# Altium schematic sheet Relay.SchDoc
size A4; SheetNumber: 3; SheetTotal: 3
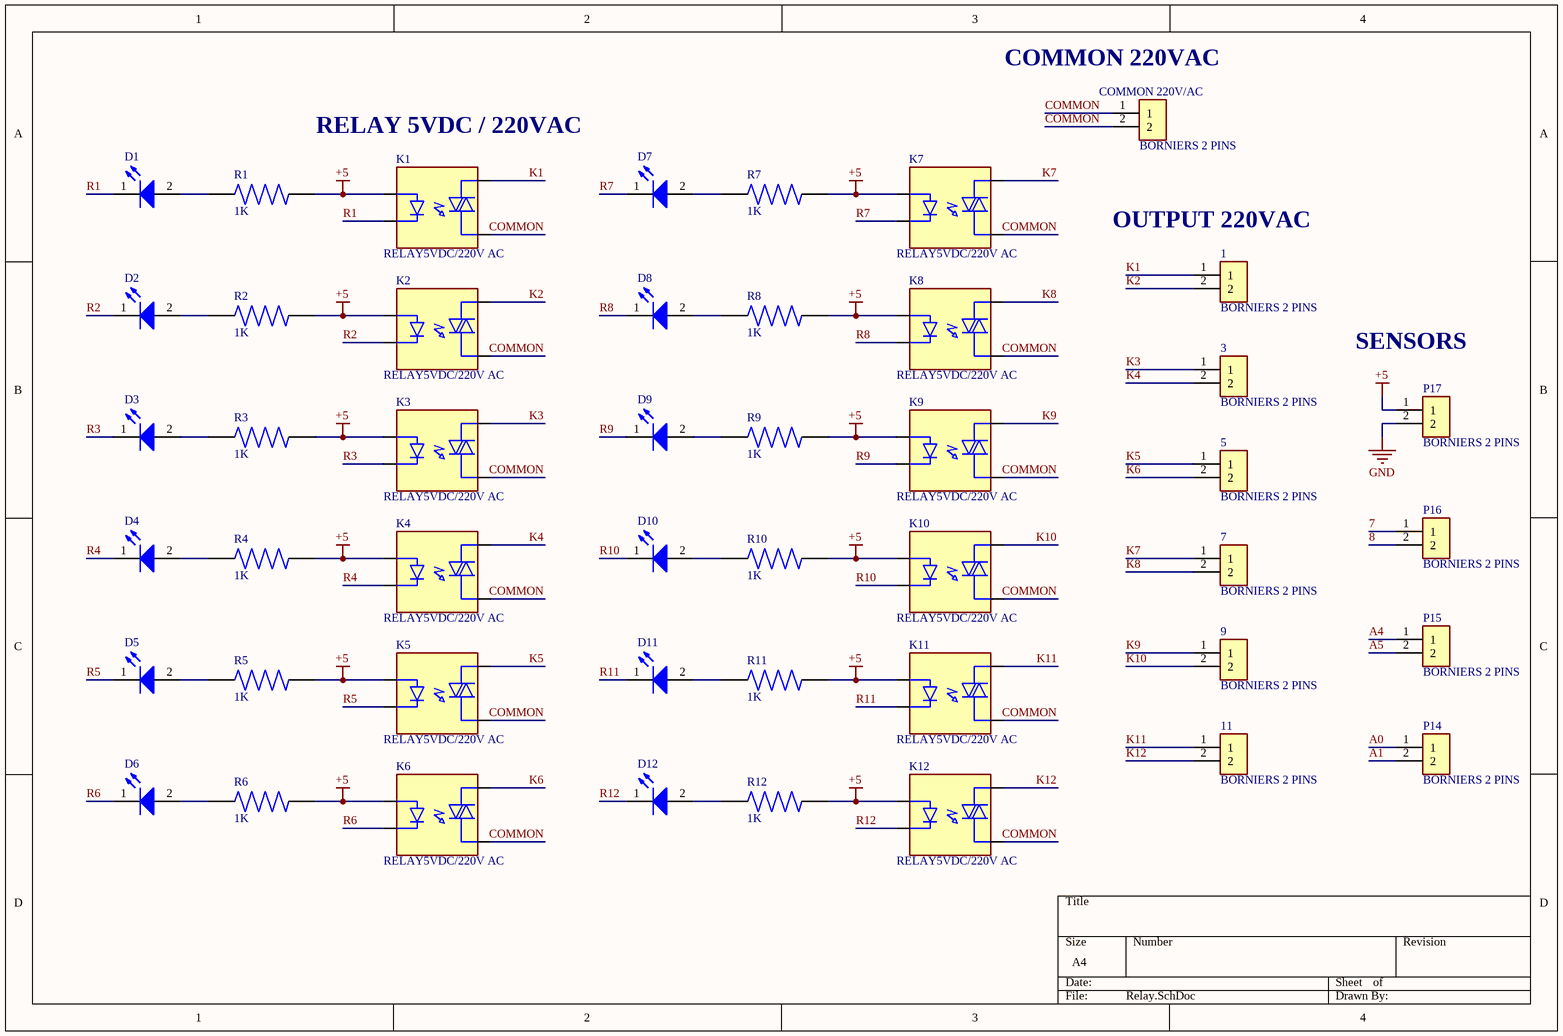
[diagram p0: Relay.SchDoc]

## Parts
1  BORNIERS 2 PINS  [BORNIERS 2 PINS]
3  BORNIERS 2 PINS  [BORNIERS 2 PINS]
5  BORNIERS 2 PINS  [BORNIERS 2 PINS]
7  BORNIERS 2 PINS  [BORNIERS 2 PINS]
9  BORNIERS 2 PINS  [BORNIERS 2 PINS]
11  BORNIERS 2 PINS  [BORNIERS 2 PINS]
COMMON_220V/AC  BORNIERS 2 PINS  [BORNIERS 2 PINS]
D1  LED 15408085BA400  [LED 15408085BA400]  (value not drawn)
D2  LED 15408085BA400  [LED 15408085BA400]  (value not drawn)
D3  LED 15408085BA400  [LED 15408085BA400]  (value not drawn)
D4  LED 15408085BA400  [LED 15408085BA400]  (value not drawn)
D5  LED 15408085BA400  [LED 15408085BA400]  (value not drawn)
D6  LED 15408085BA400  [LED 15408085BA400]  (value not drawn)
D7  LED 15408085BA400  [LED 15408085BA400]  (value not drawn)
D8  LED 15408085BA400  [LED 15408085BA400]  (value not drawn)
D9  LED 15408085BA400  [LED 15408085BA400]  (value not drawn)
D10  LED 15408085BA400  [LED 15408085BA400]  (value not drawn)
D11  LED 15408085BA400  [LED 15408085BA400]  (value not drawn)
D12  LED 15408085BA400  [LED 15408085BA400]  (value not drawn)
K1  RELAY5VDC/220V AC  [G3MB-202P DC5]
K2  RELAY5VDC/220V AC  [G3MB-202P DC5]
K3  RELAY5VDC/220V AC  [G3MB-202P DC5]
K4  RELAY5VDC/220V AC  [G3MB-202P DC5]
K5  RELAY5VDC/220V AC  [G3MB-202P DC5]
K6  RELAY5VDC/220V AC  [G3MB-202P DC5]
K7  RELAY5VDC/220V AC  [G3MB-202P DC5]
K8  RELAY5VDC/220V AC  [G3MB-202P DC5]
K9  RELAY5VDC/220V AC  [G3MB-202P DC5]
K10  RELAY5VDC/220V AC  [G3MB-202P DC5]
K11  RELAY5VDC/220V AC  [G3MB-202P DC5]
K12  RELAY5VDC/220V AC  [G3MB-202P DC5]
P14  BORNIERS 2 PINS  [BORNIERS 2 PINS]
P15  BORNIERS 2 PINS  [BORNIERS 2 PINS]
P16  BORNIERS 2 PINS  [BORNIERS 2 PINS]
P17  BORNIERS 2 PINS  [BORNIERS 2 PINS]
R1  1K  [RES FCR1206J10R]
R2  1K  [RES FCR1206J10R]
R3  1K  [RES FCR1206J10R]
R4  1K  [RES FCR1206J10R]
R5  1K  [RES FCR1206J10R]
R6  1K  [RES FCR1206J10R]
R7  1K  [RES FCR1206J10R]
R8  1K  [RES FCR1206J10R]
R9  1K  [RES FCR1206J10R]
R10  1K  [RES FCR1206J10R]
R11  1K  [RES FCR1206J10R]
R12  1K  [RES FCR1206J10R]

## Nets
+5: K1.3(ANODE) K2.3(ANODE) K3.3(ANODE) K4.3(ANODE) K5.3(ANODE) K6.3(ANODE) K7.3(ANODE) K8.3(ANODE) K9.3(ANODE) K10.3(ANODE) K11.3(ANODE) K12.3(ANODE) P17.1 R1.2 R2.2 R3.2 R4.2 R5.2 R6.2 R7.2 R8.2 R9.2 R10.2 R11.2 R12.2
GND: P17.2
7: P16.1
8: P16.2
A0: P14.1
A1: P14.2
A4: P15.1
A5: P15.2
COMMON: COMMON_220V/AC.1 COMMON_220V/AC.2 K1.2(LOAD2) K2.2(LOAD2) K3.2(LOAD2) K4.2(LOAD2) K5.2(LOAD2) K6.2(LOAD2) K7.2(LOAD2) K8.2(LOAD2) K9.2(LOAD2) K10.2(LOAD2) K11.2(LOAD2) K12.2(LOAD2)
K1: 1.1 K1.1(LOAD1)
K2: 1.2 K2.1(LOAD1)
K3: 3.1 K3.1(LOAD1)
K4: 3.2 K4.1(LOAD1)
K5: 5.1 K5.1(LOAD1)
K6: 5.2 K6.1(LOAD1)
K7: 7.1 K7.1(LOAD1)
K8: 7.2 K8.1(LOAD1)
K9: 9.1 K9.1(LOAD1)
K10: 9.2 K10.1(LOAD1)
K11: 11.1 K11.1(LOAD1)
K12: 11.2 K12.1(LOAD1)
R1: D1.1(K) K1.4(CATHODE)
R2: D2.1(K) K2.4(CATHODE)
R3: D3.1(K) K3.4(CATHODE)
R4: D4.1(K) K4.4(CATHODE)
R5: D5.1(K) K5.4(CATHODE)
R6: D6.1(K) K6.4(CATHODE)
R7: D7.1(K) K7.4(CATHODE)
R8: D8.1(K) K8.4(CATHODE)
R9: D9.1(K) K9.4(CATHODE)
R10: D10.1(K) K10.4(CATHODE)
R11: D11.1(K) K11.4(CATHODE)
R12: D12.1(K) K12.4(CATHODE)
NetD1_2: D1.2(A) R1.1
NetD2_2: D2.2(A) R2.1
NetD3_2: D3.2(A) R3.1
NetD4_2: D4.2(A) R4.1
NetD5_2: D5.2(A) R5.1
NetD6_2: D6.2(A) R6.1
NetD7_2: D7.2(A) R7.1
NetD8_2: D8.2(A) R8.1
NetD9_2: D9.2(A) R9.1
NetD10_2: D10.2(A) R10.1
NetD11_2: D11.2(A) R11.1
NetD12_2: D12.2(A) R12.1

## Notes on the sheet
- (near COMMON_220V/AC) COMMON 220VAC
- RELAY 5VDC / 220VAC
- (near 1) OUTPUT 220VAC
- SENSORS

## Library data of the parts
1 3 5 7 9 11 COMMON_220V/AC P14-P17 = BORNIERS 2 PINS: Terminal Block Connector Wire Receptacle 2
D1-D12 = LED 15408085BA400: SMT Infrared Chip LED Infrared Waterclear, body 2x1.3mm, size 0805, Infrared, 1.4V, 140°; Manufacturer: Wurth Elektronik; Match Code: WL-SICW; Case/Size Code: 0805; Centroid Wavelength: 845nm; Chip Technology: AlGaAs; Forward Voltage Max: 2V; Peak Wavelength: 850nm; Radiant Intensity: 1.5mW/sr; Radiant Intensity Min: 0.6mW/sr; Manufacturer Part Number: 15408085BA400; Category: Infrared LEDs; ComponentLink1Description: Website Link; ComponentLink1URL: https://www.we-online.com/redexpert/article/15408085BA400?ad; ComponentLink2Description: Datasheet Link; ComponentLink2URL: https://www.we-online.com/redexpert/spec/15408085BA400?ad; Mount: Surface Mount; Operating Temperature Max: 85°C; Operating Temperature Min: -40°C; Packaging: Tape and Reel; Length: 2mm; Width: 1.3mm; Height: 0.8mm; Emitting Color: Infrared; Forward Voltage: 1.4V; Viewing Angle: 140°
K1-K12 = G3MB-202P DC5: Solid State Photo-Coupled Relay (PhotoRelay) SPST-NO (1 Form A) 4-SIP; MF: Omron Automation; SnapEDA_Link: https://www.snapeda.com/parts/G3MB-202P/Omron/view-part/?ref=snap; Package: SIP-4 Omron Automation; Value: *; MP: G3MB-202P; Check_prices: https://www.snapeda.com/parts/G3MB-202P/Omron/view-part/?ref=eda
R1-R12 = RES FCR1206J10R: RES 1206 10 Ohm 5% 1/8W ±500ppm/°C Molded SMD SMD T/R; Resistance: 10; Power_Rating: .125 W; MF: TE Connectivity; DigiKey-Purchase-URL: https://snapeda.com/shop?store=DigiKey&id=988597; Package: 1206; EU_RoHS_Compliance: Compliant with Exemptions; Tolerance: 5%; Value: *; MP: FCR1206J10R; Price: None; SnapEDA_Link: https://www.snapeda.com/parts/FCR1206J10R/TE%20Connectivity%20Passive%20Product/view-part/988597/?ref=snap; Mouser-Purchase-URL: https://snapeda.com/shop?store=Mouser&id=988597; Availability: Warning